# Altium schematic sheet emu.SchDoc
size A3
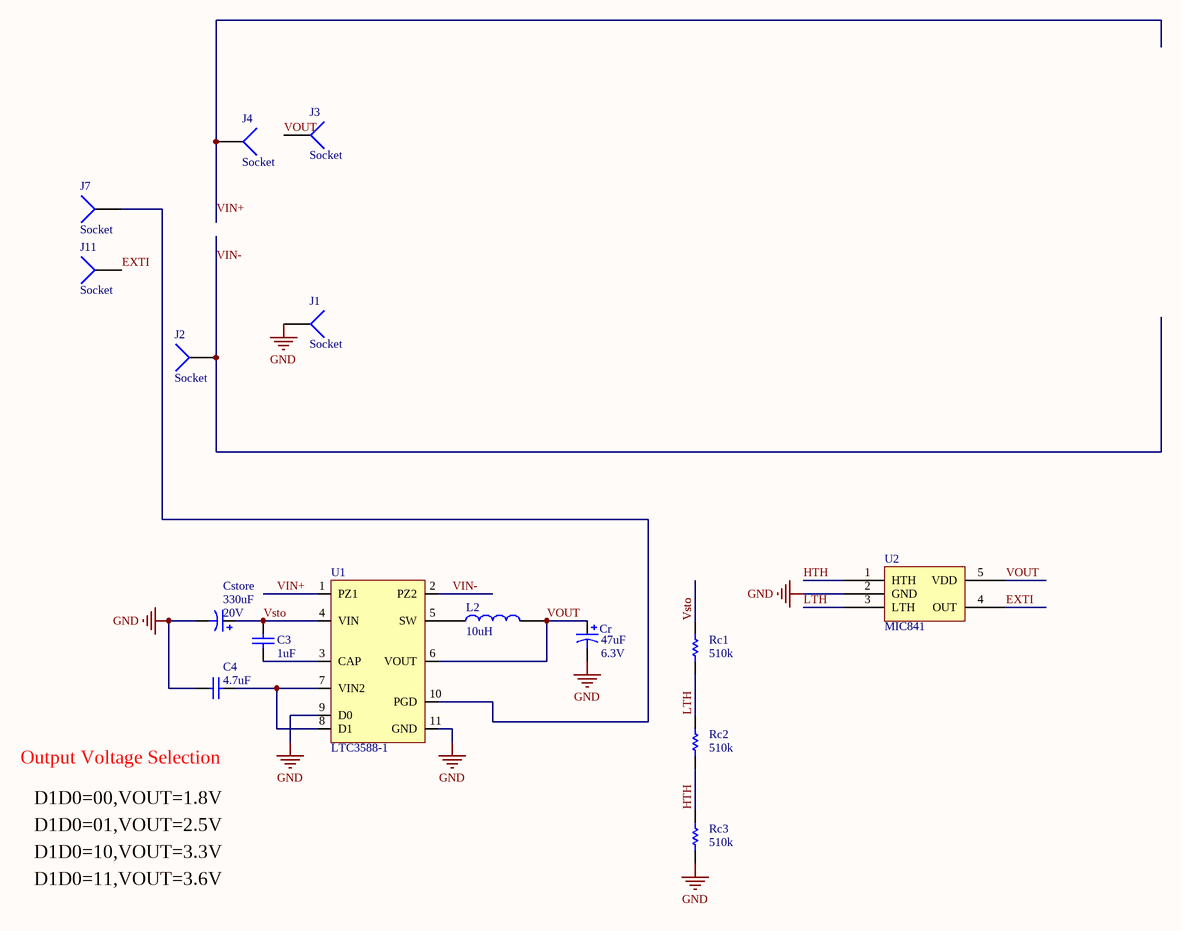
[diagram p0: emu.SchDoc]

## Parts
C3  value 1uF  [6-0805_N]  (hidden comment: CAP)
C4  value 4.7uF  [6-0805_N]  (hidden comment: CAP)
Cr  6.3V  value 47uF  [3216[1206]]
Cstore  value 330uF  Nominal Voltage: 20V  [HDR1X2]  (hidden comment: Cap Pol1)
J1  Socket  [PIN1]
J2  Socket  [PIN1]
J3  Socket  [PIN1]
J4  Socket  [PIN1]
J7  Socket  [PIN1]
J11  Socket  [PIN1]
L2  10uH  [SMD SS16]
Rc1  value 510k  [6-0805_N]  (hidden comment: Res1)
Rc2  value 510k  [6-0805_N]  (hidden comment: Res1)
Rc3  value 510k  [6-0805_N]  (hidden comment: Res1)
U1  LTC3588-1  [LTC 3588-1]
U2  MIC841  [SOT65P210X90-5L20N]

## Nets
GND: C4.2 Cr.2 Cstore.2 J1.1 Rc3.1 U1.9(D0) U1.11(GND) U2.2(GND)
EXTI: J11.1 U2.4(OUT)
HTH: Rc2.1 Rc3.2 U2.1(HTH)
LTH: Rc1.1 Rc2.2 U2.3(LTH)
VIN+: J4.1 U1.1(PZ1)
VIN-: J2.1 U1.2(PZ2)
VOUT: Cr.1 J3.1 L2.2 U1.6(VOUT) U2.5(VDD)
Vsto: C3.2 Cstore.1 Rc1.2 U1.4(VIN)
NetC3_1: C3.1 U1.3(CAP)
NetC4_1: C4.1 U1.7(VIN2) U1.8(D1)
NetJ7_1: J7.1 U1.10(PGD)
NetL2_1: L2.1 U1.5(SW)

## Notes on the sheet
- Output Voltage Selection
- D1D0=00,VOUT=1.8V
- D1D0=01,VOUT=2.5V
- D1D0=10,VOUT=3.3V
- D1D0=11,VOUT=3.6V

## Library data of the parts
C3 C4 = CAP: Capacitor; Published: 8-Jun-2000; LatestRevisionDate: 17-Jul-2002; LatestRevisionNote: Re-released for DXP Platform.; PackageReference: RAD-0.3; Publisher: Altium Limited
Cr Cstore = Cap Pol1: Polarized Capacitor (Radial); Published: 8-Jun-2000; LatestRevisionDate: 17-Jul-2002; LatestRevisionNote: Re-released for DXP Platform.; PackageReference: RB7.6-15; Publisher: Altium Limited; PackageDescription: Polarized Capacitor (Radial); 2 Leads
L2 = INDUCTOR
Rc1-Rc3 = Res1: Resistor; Published: 8-Jun-2000; LatestRevisionDate: 17-Jul-2002; LatestRevisionNote: Re-released for DXP Platform.; PackageReference: AXIAL-0.3; Publisher: Altium Limited; PackageDescription: Axial Device, Thru-Hole; 2 Leads; 0.3 in Pin Spacing
U1 = LTC3588-1: Nanopower energy harvesting power supply
U2 = Component_1
J1-J4 J7 J11 = Socket: LatestRevisionDate: 17-Jul-2002; LatestRevisionNote: Re-released for DXP Platform.; Publisher: Altium Limited